# Altium schematic sheet 001_OverViewMainHub-part2.SchDoc: Overview BAS Main Hub
size A2; Organization: Greenfield Tech Solutions; Address1: Molendreef 33; Address2: Ossendrecht; Address3: 4641CS; Address4: The Netherlands; SheetNumber: 1; SheetTotal: 9
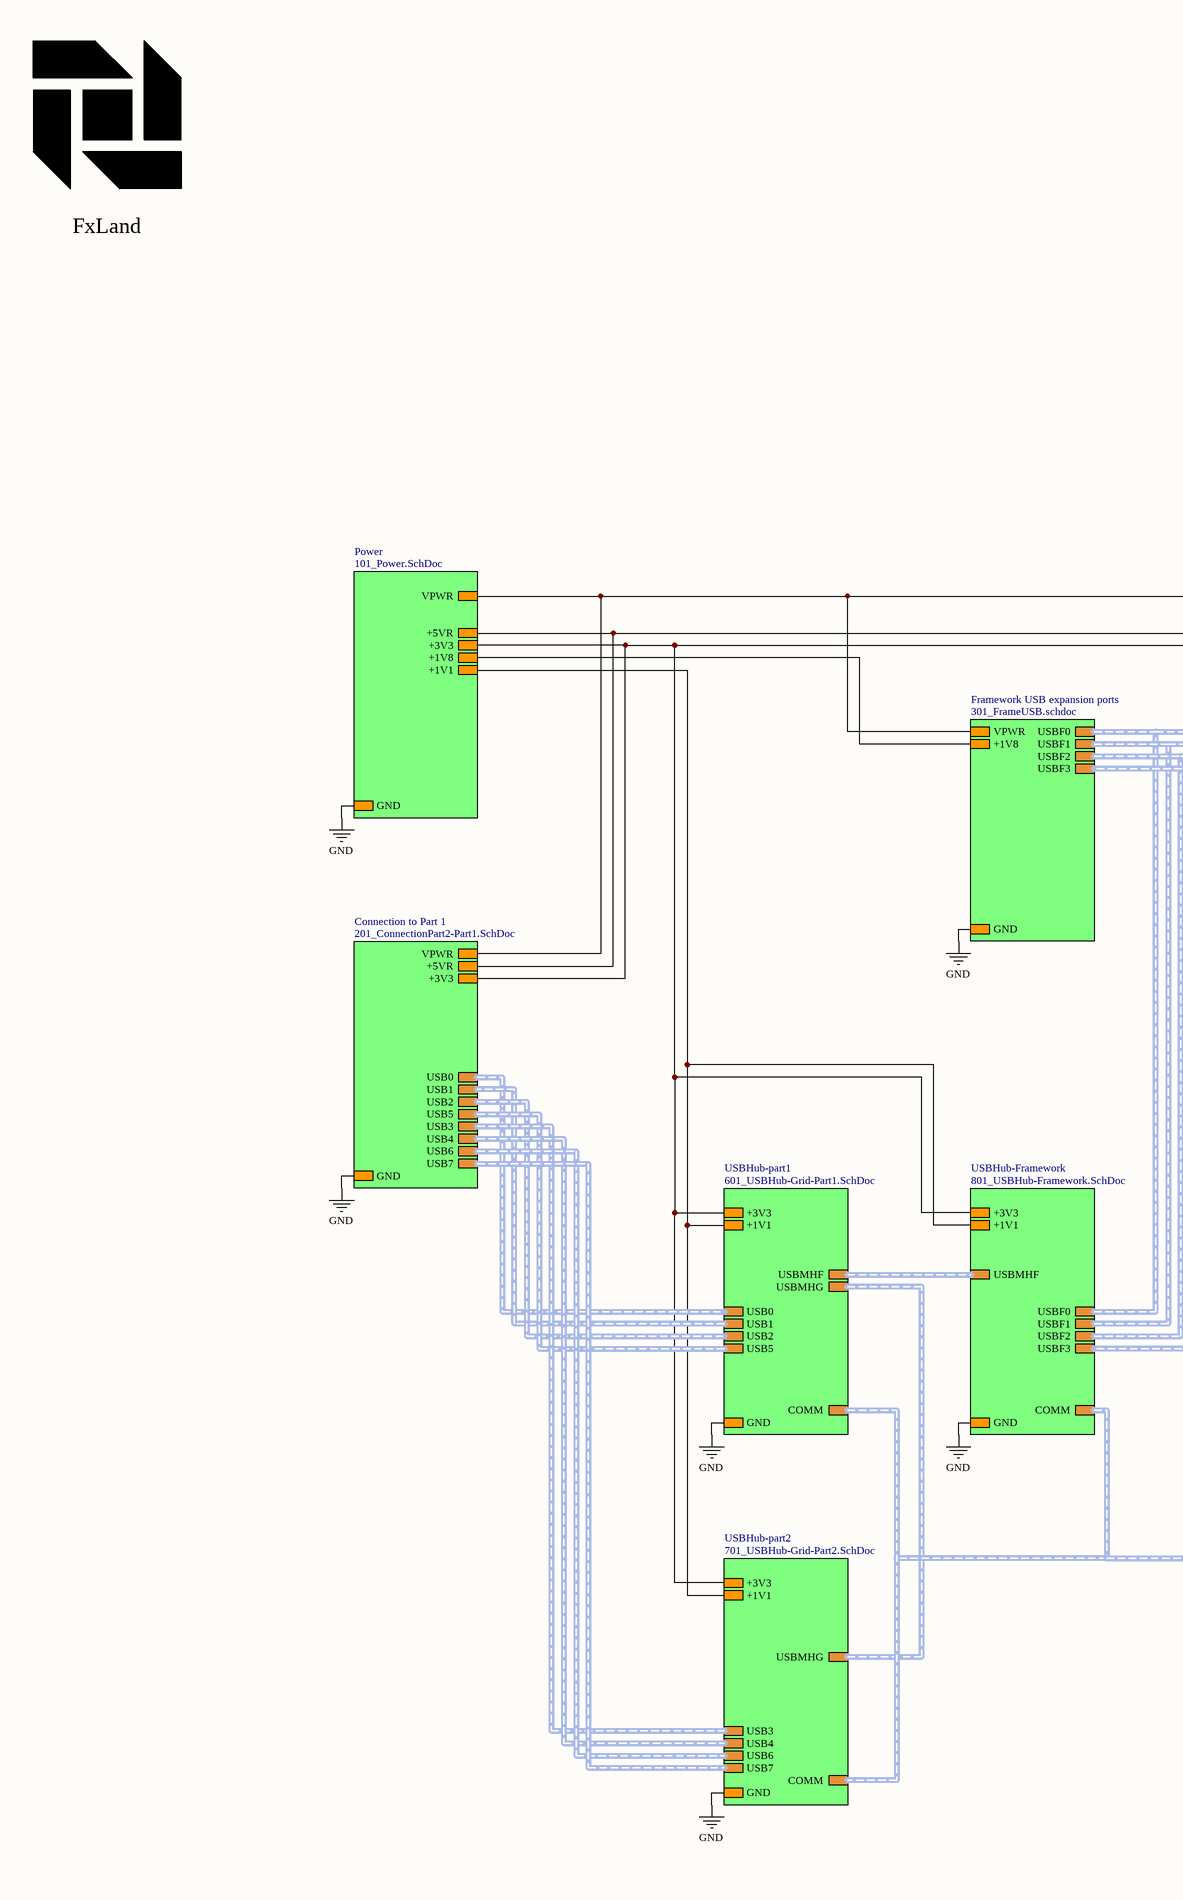
[diagram p0: 001_OverViewMainHub-part2.SchDoc, left]
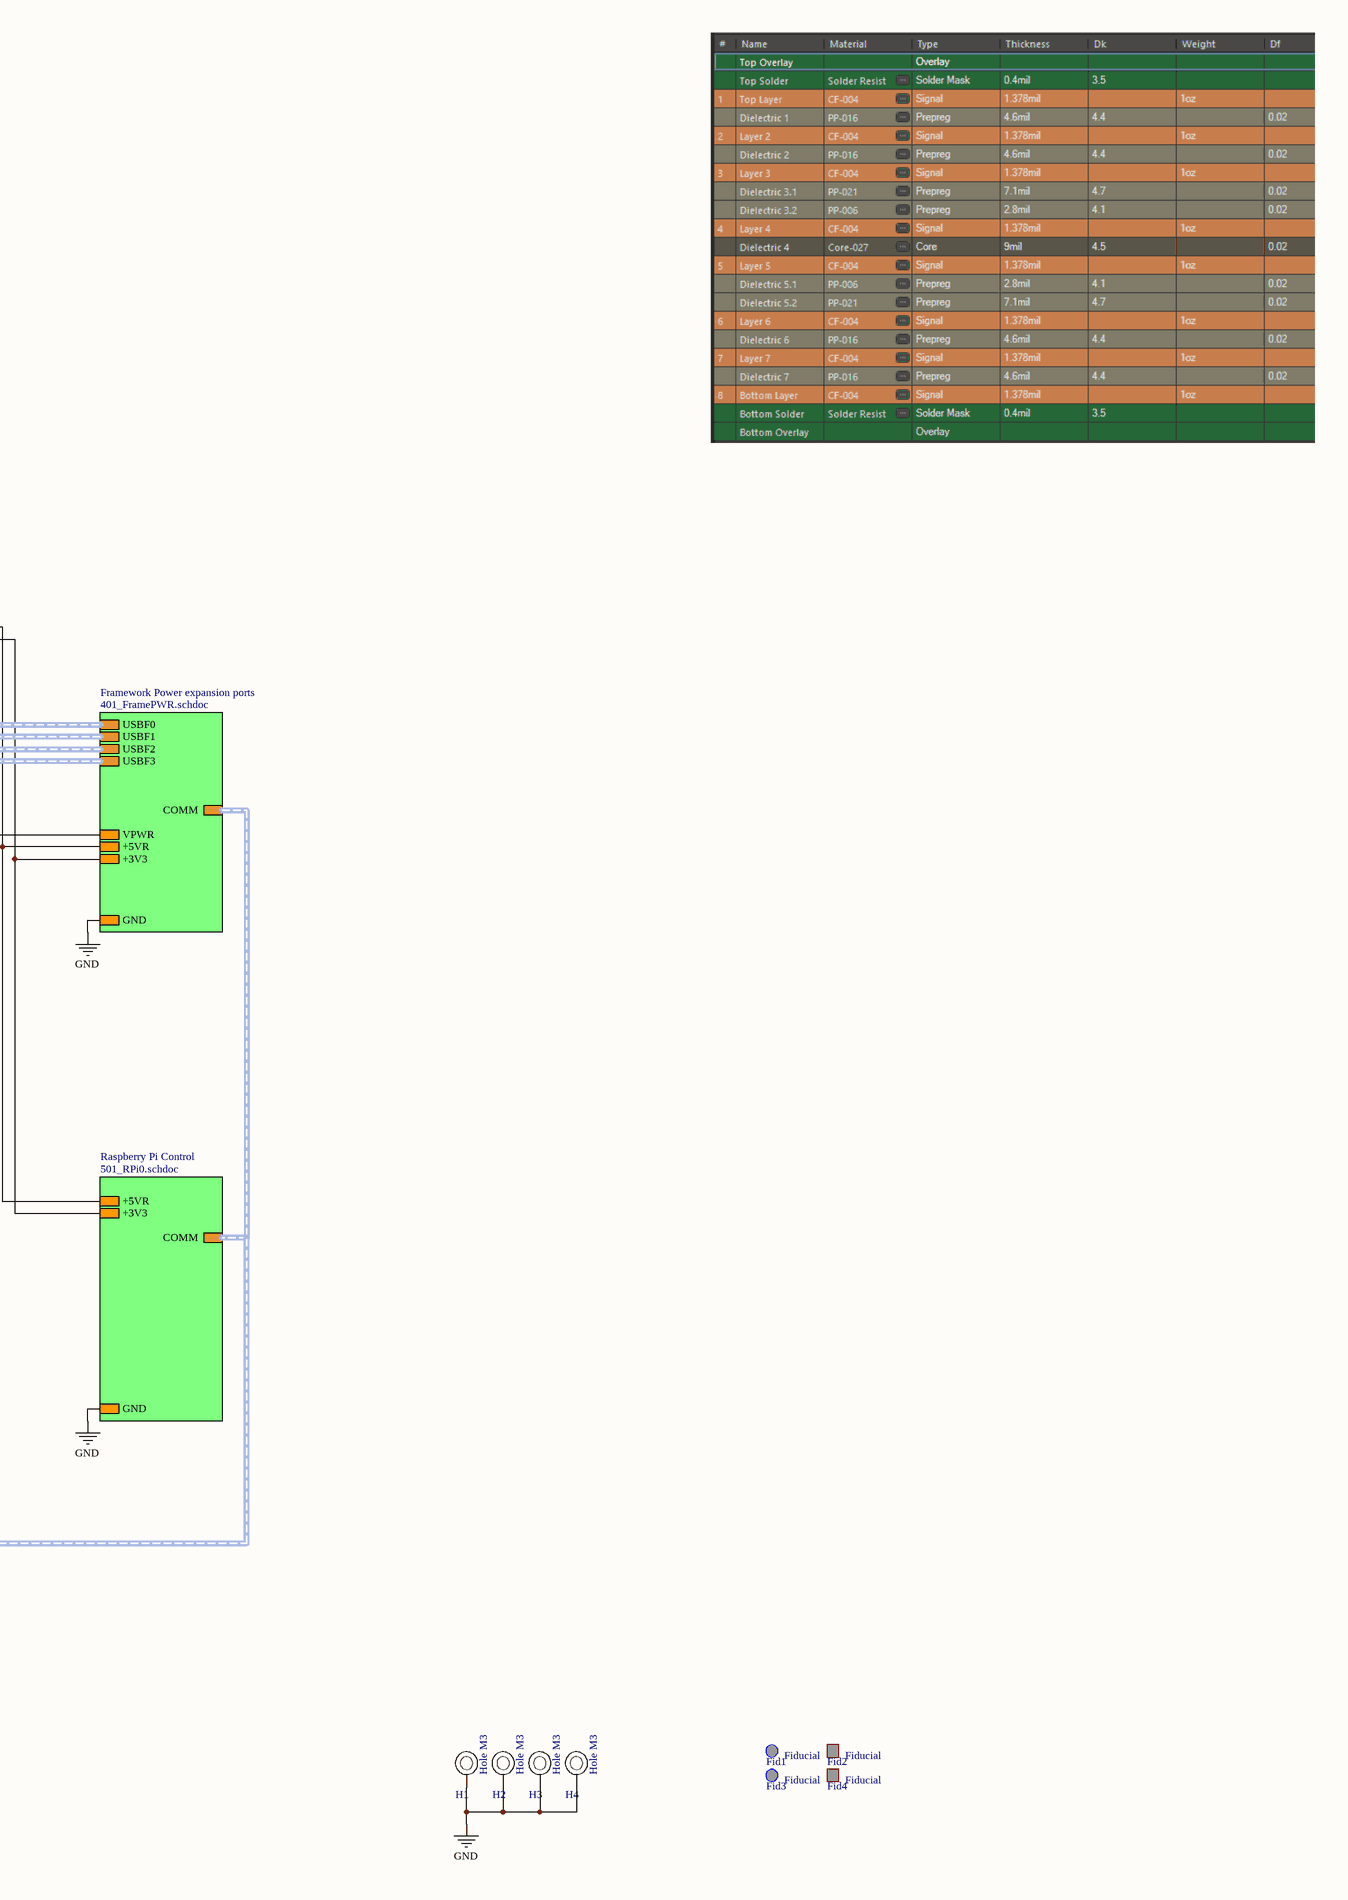
[diagram p1: 001_OverViewMainHub-part2.SchDoc, right]

## Parts
Fid1  Fiducial  [FidR_1.0mm]
Fid2  Fiducial  [FidS_1.0mm]
Fid3  Fiducial  [FidR_1.0mm]
Fid4  Fiducial  [FidS_1.0mm]
H1  Hole M3  [HOLE_M3]
H2  Hole M3  [HOLE_M3]
H3  Hole M3  [HOLE_M3]
H4  Hole M3  [HOLE_M3]
Logo_FxLand  FxLand  [Logo_FxLand_3]  (value not drawn)

## Sub-sheets
Connection to Part 1 = 201_ConnectionPart2-Part1.SchDoc: GND, VPWR, +5VR, +3V3, USB0, USB1, USB2, USB5, USB3, USB4, USB6, USB7
Framework Power expansion ports = 401_FramePWR.schdoc: GND, VPWR, +5VR, USBF0, USBF1, USBF2, USBF3, +3V3, COMM
Framework USB expansion ports = 301_FrameUSB.schdoc: GND, VPWR, USBF0, USBF1, USBF2, USBF3, +1V8
Power = 101_Power.SchDoc: GND, VPWR, +5VR, +3V3, +1V1, +1V8
Raspberry Pi Control = 501_RPi0.schdoc: GND, +5VR, COMM, +3V3
USBHub-Framework = 801_USBHub-Framework.SchDoc: GND, USBF0, USBF1, USBF2, USBF3, USBMHF, COMM, +1V1, +3V3
USBHub-part1 = 601_USBHub-Grid-Part1.SchDoc: GND, USB0, USB1, USB2, USB5, USBMHF, USBMHG, COMM, +1V1, +3V3
USBHub-part2 = 701_USBHub-Grid-Part2.SchDoc: GND, USBMHG, USB3, USB4, USB6, USB7, COMM, +1V1, +3V3

## Nets
GND: H1.1 H2.1 H3.1 H4.1 ; sheet Power/GND, sheet Framework USB expansion ports/GND, sheet Raspberry Pi Control/GND, sheet Framework Power expansion ports/GND, sheet Connection to Part 1/GND, sheet USBHub-part1/GND, sheet USBHub-Framework/GND, sheet USBHub-part2/GND
(unnamed): sheet Power/VPWR, sheet Framework USB expansion ports/VPWR, sheet Framework Power expansion ports/VPWR, sheet Connection to Part 1/VPWR
(unnamed): sheet Power/+5VR, sheet Raspberry Pi Control/+5VR, sheet Framework Power expansion ports/+5VR, sheet Connection to Part 1/+5VR
(unnamed): sheet Power/+3V3, sheet Raspberry Pi Control/+3V3, sheet Framework Power expansion ports/+3V3, sheet Connection to Part 1/+3V3, sheet USBHub-part1/+3V3, sheet USBHub-Framework/+3V3, sheet USBHub-part2/+3V3
(unnamed): sheet Power/+1V1, sheet USBHub-part1/+1V1, sheet USBHub-Framework/+1V1, sheet USBHub-part2/+1V1
(unnamed): sheet Power/+1V8, sheet Framework USB expansion ports/+1V8

## Buses and harness runs
harness sheet Connection to Part 1/USB0 = sheet USBHub-part1/USB0
harness sheet Connection to Part 1/USB1 = sheet USBHub-part1/USB1
harness sheet Connection to Part 1/USB2 = sheet USBHub-part1/USB2
harness sheet Connection to Part 1/USB3 = sheet USBHub-part2/USB3
harness sheet Connection to Part 1/USB4 = sheet USBHub-part2/USB4
harness sheet Connection to Part 1/USB5 = sheet USBHub-part1/USB5
harness sheet Connection to Part 1/USB6 = sheet USBHub-part2/USB6
harness sheet Connection to Part 1/USB7 = sheet USBHub-part2/USB7
harness sheet Framework Power expansion ports/COMM = sheet Raspberry Pi Control/COMM = sheet USBHub-Framework/COMM = sheet USBHub-part1/COMM = sheet USBHub-part2/COMM
harness sheet Framework Power expansion ports/USBF0 = sheet Framework USB expansion ports/USBF0 = sheet USBHub-Framework/USBF0
harness sheet Framework Power expansion ports/USBF1 = sheet Framework USB expansion ports/USBF1 = sheet USBHub-Framework/USBF1
harness sheet Framework Power expansion ports/USBF2 = sheet Framework USB expansion ports/USBF2 = sheet USBHub-Framework/USBF2
harness sheet Framework Power expansion ports/USBF3 = sheet Framework USB expansion ports/USBF3 = sheet USBHub-Framework/USBF3
harness sheet USBHub-Framework/USBMHF = sheet USBHub-part1/USBMHF
harness sheet USBHub-part1/USBMHG = sheet USBHub-part2/USBMHG

## Notes on the sheet
- Title
- Size:
- Date:
- File:
- A2
- Number:
- Time:
- Revision:
- Sheet
- of

## Library data of the parts
Fid1 Fid3 = ME0011: Fiducial Round 1mm; Part Number: ME0011; ID: 11; RefVal: Fiducial
Fid2 Fid4 = ME0012: Fiducial Sqaure 1mm; Part Number: ME0012; ID: 12; RefVal: Fiducial
H1-H4 = ME0001: Mounting Hole M3; Part Number: ME0001; ID: 1; RefVal: Hole M3
Logo_FxLand = ME0008: Logo FxLand 3; Part Number: ME0008; ID: 8; RefVal: FxLand